# Altium schematic sheet SD_Card.SchDoc: MoonPilot - SD Card
size A3; DrawnBy: Máni Magnússon; Revision: A; SheetNumber: 8
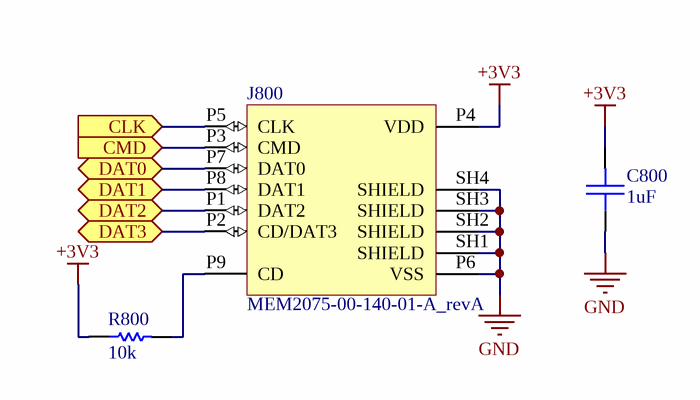
[diagram p0: SD_Card.SchDoc]

## Parts
C800  1uF  [0603_CAP]
J800  MEM2075-00-140-01-A_revA  [MEM2075-00-140-01-A_revA]
R800  10k  [0603_RES]

## Ports
CLK (in), CMD (in), DAT0 (bidir), DAT1 (bidir), DAT2 (bidir), DAT3 (bidir)

## Nets
+3V3: C800.1 J800.P4(VDD) R800.1
GND: C800.2 J800.P6(VSS) J800.SH1(SHIELD) J800.SH2(SHIELD) J800.SH3(SHIELD) J800.SH4(SHIELD)
CLK: J800.P5(CLK) ; port CLK
CMD: J800.P3(CMD) ; port CMD
DAT0: J800.P7(DAT0) ; port DAT0
DAT1: J800.P8(DAT1) ; port DAT1
DAT2: J800.P1(DAT2) ; port DAT2
DAT3: J800.P2(CD/DAT3) ; port DAT3
NetJ800_P9: J800.P9(CD) R800.2

## Notes on the sheet
- Sheet title:
- Revision:
- Drawn by:
- Date:
- File:

## Library data of the parts
C800 = Capacitor
J800 = MicroSD Card holder: Push-Push style MicroSD Card holder / Digikey part no. 2073-MEM2075-00-140-01-ACT-ND; Manufacturer: GCT; PartRev: A; STANDARD: Manufacturer Recommendations; Package: GCT_MEM2075-00-140-01-A_revA
R800 = Resistor